# EAGLE schematic untitled (EAGLE 9.6.2)
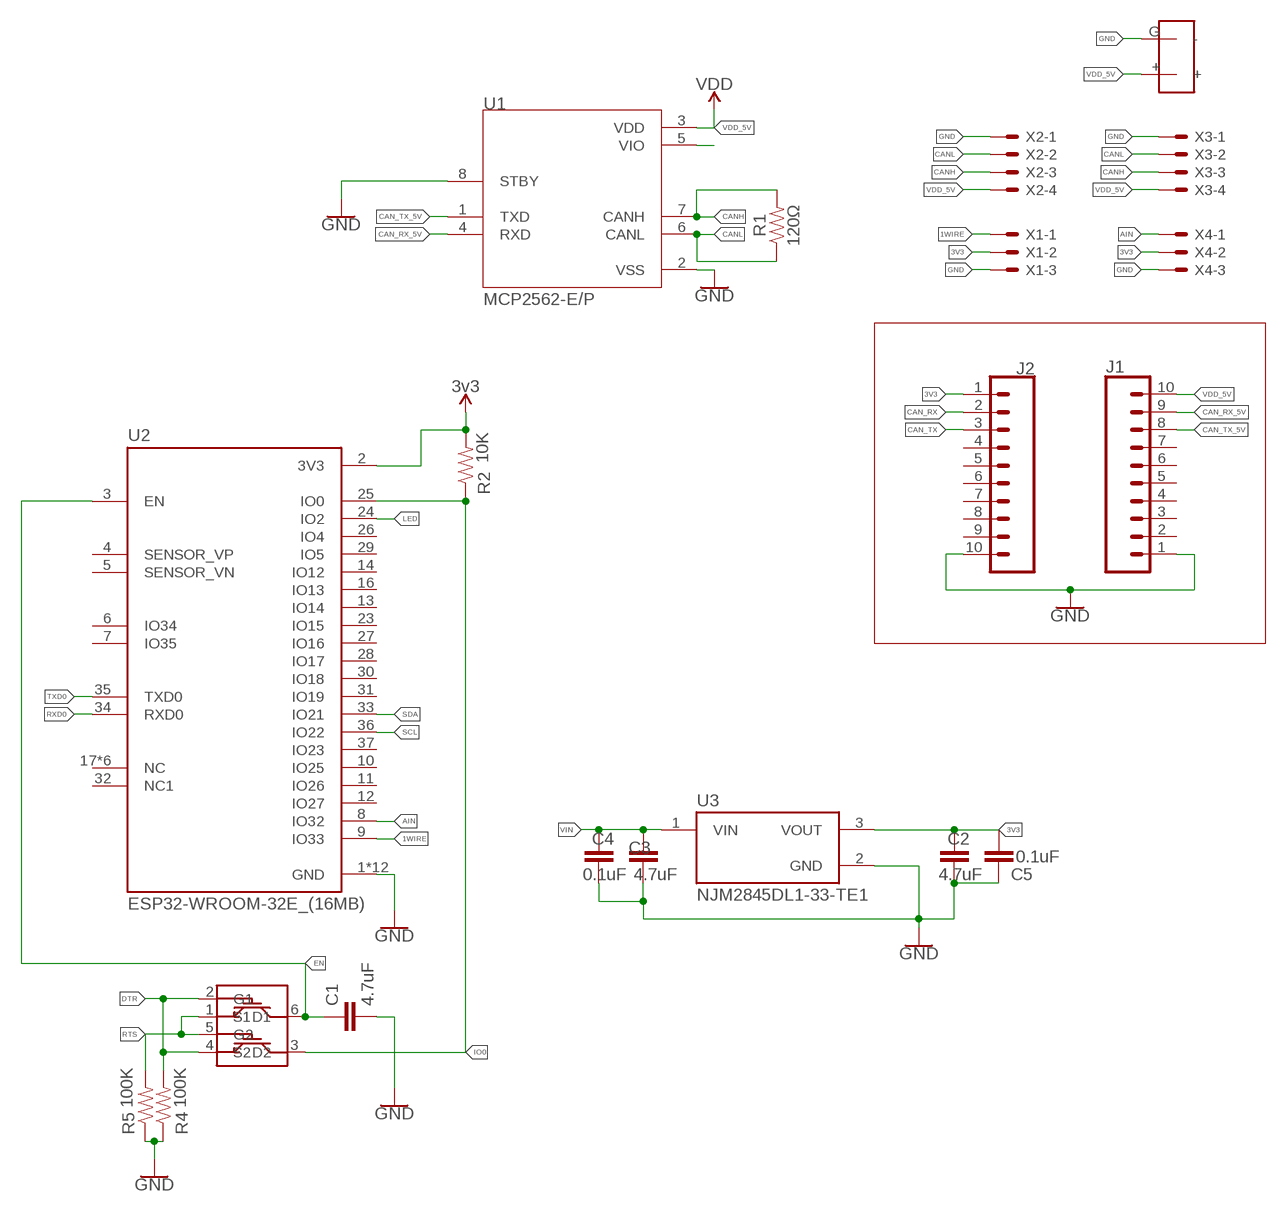
[diagram p0: schematic, sheet 1]

## Parts
C1  4.7uF  4.7UF-0603-6.3V-(10%)  [0603]
C2  4.7uF  4.7UF-0603-6.3V-(10%)  [0603]
C3  4.7uF  4.7UF-0603-6.3V-(10%)  [0603]
C4  0.1uF  0.1UF-0603-25V-(+80/-20%)  [0603]
C5  0.1uF  0.1UF-0603-25V-(+80/-20%)  [0603]
J1  CONN_10"  [1X10]
J2  CONN_10"  [1X10]
R1  120Ω  RESISTORAXIAL-0.3  [AXIAL-0.3]
R2  10K  4.7KOHM-0603-1/10W-1%  [0603]
R4  100K  4.7KOHM-0603-1/10W-1%  [0603]
R5  100K  4.7KOHM-0603-1/10W-1%  [0603]
U1  MCP2562-E/P  [DIP787W45P254L1016H533Q8]
U2  ESP32-WROOM-32E_(16MB)  [XCVR_ESP32-WROOM-32E_(16MB)]
U3  NJM2845DL1-33-TE1  [DPAK228P968X238-4N]
U$1  2N7002DW  [SOT363]
U$2  BAT  [BAT]
X1  JST-XH-03-PIN-LONG-PAD  [JST-XH-03-PACKAGE-LONG-PAD]
X2  JST-XH-04-PIN-LONG-PAD  [JST-XH-04-PACKAGE-LONG-PAD]
X3  JST-XH-04-PIN-LONG-PAD  [JST-XH-04-PACKAGE-LONG-PAD]
X4  JST-XH-03-PIN-LONG-PAD  [JST-XH-03-PACKAGE-LONG-PAD]

## Nets
1WIRE: U2.9(IO33) X1.1
3V3: C2.1 C5.2 J2.1 R2.2 U2.2(3V3) U3.3(VOUT) X1.2 X4.2 ; supply symbol labelled 3v3
AIN: U2.8(IO32) X4.1
CAN_RX: J2.2
CAN_RX_5V: J1.9 U1.4(RXD)
CAN_TX: J2.3
CAN_TX_5V: J1.8 U1.1(TXD)
CANH: R1.P$2 U1.7(CANH) X2.3 X3.3
CANL: R1.P$1 U1.6(CANL) X2.2 X3.2
DTR: R4.2 U$1.2(G1) U$1.4(S2)
EN: C1.1 U2.3(EN) U$1.6(D1)
GND: C1.2 C2.2 C3.1 C4.2 C5.1 J1.1 J2.10 U1.2(VSS) U1.8(STBY) U2.1(GND) U2.15(GND) U2.38(GND) U2.39_1(GND) U2.39_2(GND) U2.39_3(GND) U2.39_4(GND) U2.39_5(GND) U2.39_6(GND) U2.39_7(GND) U2.39_8(GND) U2.39_9(GND) U3.2(GND) U$2.G(-) X1.3 X2.1 X3.1 X4.3
IO0: R2.1 U2.25(IO0) U$1.3(D2)
LED: U2.24(IO2)
N$3: R4.1 R5.1 ; supply symbol labelled GND
N$7: U1.5(VIO)
RTS: R5.2 U$1.1(S1) U$1.5(G2)
RXD0: U2.34(RXD0)
SCL: U2.36(IO22)
SDA: U2.33(IO21)
TXD0: U2.35(TXD0)
VDD_5V: J1.10 U1.3(VDD) U$2.+ X2.4 X3.4 ; supply symbol labelled VDD
VIN: C3.2 C4.1 U3.1(VIN)
Unconnected: J1.2 J1.3 J1.4 J1.5 J1.6 J1.7 J2.4 J2.5 J2.6 J2.7 J2.8 J2.9 U2.4(SENSOR_VP) U2.5(SENSOR_VN) U2.6(IO34) U2.7(IO35) U2.10(IO25) U2.11(IO26) U2.12(IO27) U2.13(IO14) U2.14(IO12) U2.16(IO13) U2.17(NC) U2.18(NC) U2.19(NC) U2.20(NC) U2.21(NC) U2.22(NC) U2.23(IO15) U2.26(IO4) U2.27(IO16) U2.28(IO17) U2.29(IO5) U2.30(IO18) U2.31(IO19) U2.32(NC1) U2.37(IO23)

## Library data of the parts
C1-C3 = SparkFun-Capacitors:4.7UF: 4.7µF ceramic capacitors A capacitor is a passive two-terminal electrical component used to store electrical energy temporarily in an electric field.; PROD_ID: CAP-08280
C4 C5 = SparkFun-Capacitors:0.1UF: 0.1µF ceramic capacitors A capacitor is a passive two-terminal electrical component used to store electrical energy temporarily in an electric field.; PROD_ID: CAP-00810
J1 J2 = SparkFun-Connectors:CONN_10: Multi connection point. Often used as Generic Header-pin footprint for 0.1 inch spaced/style header connections On any of the 0.1 inch spaced packages, you can populate with these: Break Away Headers - Straight <https://www.sparkfun.com/products/116> (PRT-00116) Break Away Male Headers - Right Angle <https://www.sparkfun.com/products/553> (PRT-00553) Female Headers <https://www.sparkfun.com/products/115> (PRT-00115) Break Away Headers - Machine Pin <https://www.sparkfun.com/products/117> (PRT-00117) Break Away Female Headers - Swiss Machine Pin <https://www.sparkfun.com/products/743> (PRT-00743) Arduino Stackable Header - 10 Pin <https://www.sparkfun.com/products/11376> (PRT-11376) For SCREWTERMINALS and SPRING TERMINALS visit here: Screw Terimnals on SparkFun.com <https://www.sparkfun.com/search/results?term=Screw+Terminals> (5mm/3.5mm/2.54mm spacing) This device is also useful as a general connection point to wire up your design to another part of your project. Our various solder wires solder well into these plated through hole pads. Hook-Up Wire - Assortment (Stranded, 22 AWG) <https://www.sparkfun.com/products/11375> (PRT-11375) Hook-Up Wire - Assortment (Solid Core, 22 AWG) <https://www.sparkfun.com/products/11367> (PRT-11367) View the entire wire category on our website here <https://www.sparkfun.com/categories/141> Special notes: Molex polarized connector foot print use with SKU : PRT-08231 with associated crimp pins and housings. 1MM SMD Version SKU: PRT-10208 NOTES ON THE VARIANTS LOCK and LOCK_LONGPADS... This footprint was designed to help hold the alignment of a through-hole component (i.e. 6-pin header) while soldering it into place. You may notice that each hole has been shifted either up or down by 0.005 of an inch from it's more standard position (which is a perfectly straight line). This slight alteration caused the pins (the squares in the middle) to touch the edges of the holes. Because they are alternating, it causes a "brace" to hold the component in place. 0.005 has proven to be the perfect amount of "off-center" position when using our standard breakaway headers. Although looks a little odd when you look at the bare footprint, once you have a header in there, the alteration is very hard to notice. Also,if you push a header all the way into place, it is covered up entirely on the bottom side.; PROD_ID: CONN-11563
R1 = SparkFun-Resistors:RESISTOR: Generic Resistor Package
R2 R4 R5 = SparkFun-Resistors:4.7KOHM: 4.7kΩ resistor A resistor is a passive two-terminal electrical component that implements electrical resistance as a circuit element. Resistors act to reduce current flow, and, at the same time, act to lower voltage levels within circuits. - Wikipedia; PROD_ID: RES-07857; VALUE: 4.7k
U1 = MCP2562-E_P:MCP2562-E/P: Integrated circuit: transceiver CAN; Channels: 1; 1Mbps; DIP8 Check availability <https://pricing.snapeda.com/parts/MCP2562-E/P/Microchip/view-part?ref=eda>; AVAILABILITY: In Stock; DESCRIPTION: 1/1 Transceiver Half CANbus 8-PDIP; MF: Microchip; MP: MCP2562-E/P; PACKAGE: DIP-8 Microchip; PRICE: None; PURCHASE-URL: https://pricing.snapeda.com/search/part/MCP2562-E/P/?ref=eda
U2 = ESP32-WROOM-32E__16MB_:ESP32-WROOM-32E_(16MB): Check availability <https://pricing.snapeda.com/parts/ESP32-WROOM-32E%20%2816MB%29/Espressif%20Systems/view-part?ref=eda>; AVAILABILITY: In Stock; DESCRIPTION: Bluetooth, WiFi 802.11b/g/n, Bluetooth v4.2 +EDR, Class 1, 2 and 3 Transceiver Module 2.4GHz ~ 2.5GHz Integrated, Trace Surface Mount; MF: Espressif Systems; MP: ESP32-WROOM-32E (16MB); PACKAGE: None; PRICE: None
U3 = NJM2845DL1-33-TE1:NJM2845DL1-33-TE1: NJM2845 Series 800 mA 3.3 V Fixed Output SMT LDO Regulator - TO-252 Check availability <https://pricing.snapeda.com/parts/NJM2845DL1-33-TE1/NJR%20Corporation/NJRC/view-part?ref=eda>; AVAILABILITY: In Stock; DESCRIPTION: Linear Voltage Regulator IC Positive Fixed 1 Output 800mA TO-252-3; MF: NJR Corporation/NJRC; MP: NJM2845DL1-33-TE1; PACKAGE: TO-252-3 New Japan Radio; PRICE: None; PURCHASE-URL: https://pricing.snapeda.com/search/part/NJM2845DL1-33-TE1/?ref=eda
U$1 = 2N7002DW:2N7002DW: Check availability <https://pricing.snapeda.com/parts/2N7002DW/ON%20Semiconductor/view-part?ref=eda>; AVAILABILITY: In Stock; DESCRIPTION: Mosfet Array 2 N-Channel (Dual) 60V 115mA 200mW Surface Mount SC-88 (SC-70-6); MF: ON Semiconductor; MP: 2N7002DW; PACKAGE: SC-88-6 ON Semiconductor; PRICE: None; PURCHASE-URL: https://pricing.snapeda.com/search/part/2N7002DW/?ref=eda
U$2 = BAT:BAT
X1 X4 = JST XH Connectors:JST-XH-03-PIN: JST XH Connector 2 Pin Wire to board connector. Pitch: 2,54 mm, (0.100") Number of pins: 3 Created by Rembrandt Electronics www.rembrandtelectronics.com
X2 X3 = JST XH Connectors:JST-XH-04-PIN: JST XH Connector 2 Pin Wire to board connector. Pitch: 2,54 mm, (0.100") Number of pins: 4 Created by Rembrandt Electronics www.rembrandtelectronics.com